# Altium schematic sheet 06-NOTStatusLed.SchDoc
size A4; DocumentNumber: 6; SheetNumber: 6; SheetTotal: 26
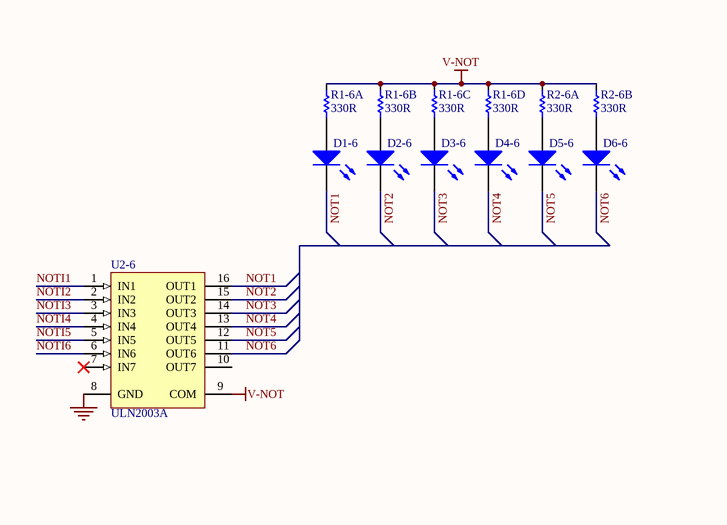
[diagram p0: 06-NOTStatusLed.SchDoc, left]
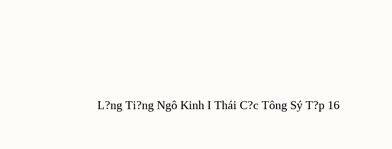
[diagram p1: 06-NOTStatusLed.SchDoc, right]

## Parts
D1-6  LED  [LED-0805]  (value not drawn)
D2-6  LED  [LED-0805]  (value not drawn)
D3-6  LED  [LED-0805]  (value not drawn)
D4-6  LED  [LED-0805]  (value not drawn)
D5-6  LED  [LED-0805]  (value not drawn)
D6-6  LED  [LED-0805]  (value not drawn)
R1-6  330R  [R-Array-0603-4]  (parts A,B,C,D of 4)
R2-6  330R  [R-Array-0603-4]  (parts A,B of 4)
U2-6  ULN2003A  [SOIC-16]

## Nets
GND: U2-6.8(GND)
V-NOT: R1-6.2 R1-6.4 R1-6.6 R1-6.8 R2-6.2 R2-6.4 U2-6.9(COM)
NOT1: D1-6.2(K) U2-6.16(OUT1)
NOT2: D2-6.2(K) U2-6.15(OUT2)
NOT3: D3-6.2(K) U2-6.14(OUT3)
NOT4: D4-6.2(K) U2-6.13(OUT4)
NOT5: D5-6.2(K) U2-6.12(OUT5)
NOT6: D6-6.2(K) U2-6.11(OUT6)
NOTI1: U2-6.1(IN1)
NOTI2: U2-6.2(IN2)
NOTI3: U2-6.3(IN3)
NOTI4: U2-6.4(IN4)
NOTI5: U2-6.5(IN5)
NOTI6: U2-6.6(IN6)
NetD1-6_1: D1-6.1(A) R1-6.1
NetD2-6_1: D2-6.1(A) R1-6.3
NetD3-6_1: D3-6.1(A) R1-6.5
NetD4-6_1: D4-6.1(A) R1-6.7
NetD5-6_1: D5-6.1(A) R2-6.1
NetD6-6_1: D6-6.1(A) R2-6.3

Not connected (* = marked no-connect by the designer): U2-6 7(IN7)* 10(OUT7)

## Notes on the sheet
- L?ng Ti?ng Ngô Kinh I Thái C?c Tông Sý T?p 16

## Library data of the parts
D1-6 D2-6 D3-6 D4-6 D5-6 D6-6 = LED2: Typical RED, GREEN, YELLOW, AMBER GaAs LED; Published: 8-Jun-2000; LatestRevisionDate: 17-Jul-2002; LatestRevisionNote: Re-released for DXP Platform.; PackageVersion: Feb-2002; PackageReference: 3.2X1.6X1.1; Publisher: Altium Limited; PackageDescription: SM LED; 2 Flat Leads
R1-6 R2-6 = Res Array 4: RES ARRAY 4 RES 330 OHM 1206; Manufacturer: Panasonic Electronic Components; Manufacturer Part Number: EXB-38V331JV; Digi-Key Part Number: Y9331TR-ND; Link: http://www.digikey.com/product-detail/en/EXB-38V331JV/Y9331TR-ND/256525
U2-6 = ULN2003A: High-Voltage, High-Current Darlington Array; Published: 13-Oct-2000; LatestRevisionDate: 06-Jun-2005; LatestRevisionNote: Stylized 3D Model Added.; DatasheetVersion: 1998; PackageVersion: 1998; PackageReference: A16; Publisher: Altium Limited; PackageDescription: DIP; 16 Leads; Row Spacing 7.62 mm; Pitch 2.54 mm; Code_JEDEC: MS-001-BB; ComponentLink1Description: Manufacturer Link; ComponentLink1URL: http://www.allegromicro.com/